# Altium schematic sheet CP2104-FO3-GM.SchDoc
size A4
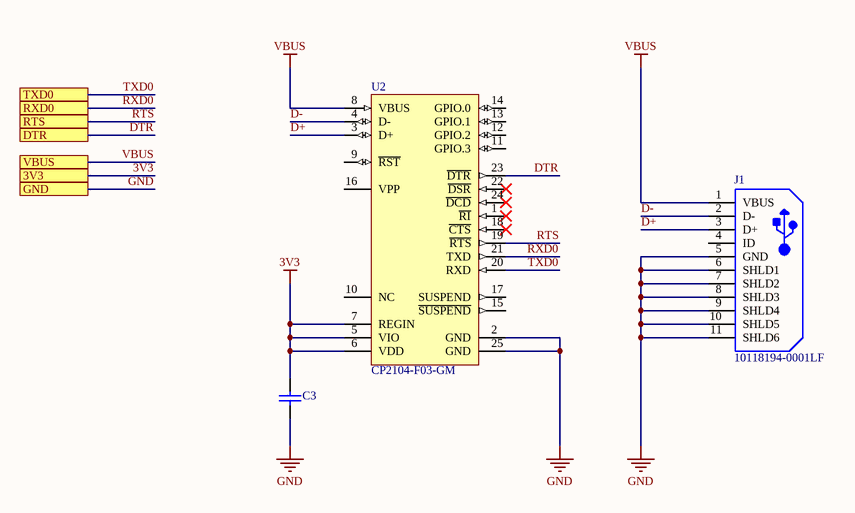
[diagram p0: CP2104-FO3-GM.SchDoc]

## Parts
C3  C0805C106K4PACTU  [CAPC2013X140X50NL20T25]  (value not drawn)
J1  10118194-0001LF  [FCI-10118194-0001LF-5_V]
U2  CP2104-F03-GM  [SLAB-QFN-24-2675x2675TP_M]

## Ports
3V3, DTR, GND, RTS, RXD0, TXD0, VBUS

## Nets
3V3: C3.2 U2.5(VIO) U2.6(VDD) U2.7(REGIN) ; port 3V3
GND: C3.1 J1.5(GND) J1.6(SHLD1) J1.7(SHLD2) J1.8(SHLD3) J1.9(SHLD4) J1.10(SHLD5) J1.11(SHLD6) U2.2(GND) U2.25(GND) ; port GND
VBUS: J1.1(VBUS) U2.8(VBUS) ; port VBUS
D+: J1.3(D+) U2.3(D+)
D-: J1.2(D-) U2.4(D-)
DTR: U2.23(~{DTR}) ; port DTR
RTS: U2.19(~{RTS}) ; port RTS
RXD0: U2.21(TXD) ; port RXD0
TXD0: U2.20(RXD) ; port TXD0

Not connected (* = marked no-connect by the designer): J1 4(ID); U2 1(~{RI})* 9(~{RST}) 10(NC) 11(GPIO.3) 12(GPIO.2) 13(GPIO.1) 14(GPIO.0) 15(~{SUSPEND}) 16(VPP) 17(SUSPEND) 18(~{CTS})* 22(~{DSR})* 24(~{DCD})*

## Library data of the parts
C3 = CMP-2007-03242-1: 10µF ±10% 16V Ceramic Capacitor X5R 0805 (2012 Metric); Part Number: CL21A106KOQNNNG
J1 = CMP-2000-05120-1: Micro USB B Type Receptacle, 1.8 A, -55 to 85 degC, 5-Pin SMD, RoHS, Tape and Reel; Manufacturer: Amphenol FCI; Body Orientation: RightAngle; Number of Contacts: 5; Pitch: 0.65mm; Gender: RCP; Rad Hard: No; Package Reference: 10118194-0001LF-5; Mounting: SurfaceMount; Manufacturer URL: http://www.fci.com/; Packaging: CutTape; Datasheet URL: https://datasheet.ciiva.com/26945/getdatasheetpartid-418619-26945695.pdf; Termination Method: Solder; Package Description: 5-Pin Surface Mount Device, Body 8.05 x 5.53 mm, Pitch 0.65 mm; Type: MicroUSBTypeB; Datasheet Version: Rev. A, 10/2011
U2 = CMP-0511-00004-1: Single-Chip USB to UART Bridge, 4 Dig I/O Pins, Internal Oscillator, 1024 Bytes EEPROM, -40 to 85 degC, 24-pin QFN; Manufacturer: Silicon Labs; Sub-Family: USB Bridges; Internal Oscillator: TRUE; Mounting Technology: Surface Mount; ComponentLink3URL: http://www.silabs.com/Support%20Documents/TechnicalDocs/C8051F93x-92x.pdf; DatasheetVersion: Rev. 1.0; ComponentLink1URL: http://www.silabs.com/; Code_IPC: J-STD-020; ComponentLink2URL: http://www.silabs.com/Support%20Documents/TechnicalDocs/cp2104.pdf; Code_JEDEC: MO-220; PackageReference: QFN-24; ComponentLink3Description: Package Specification; PartNumber: CP2104-F03-GM; ComponentLink1Description: Manufacturer URL; ComponentLink2Description: Datasheet; EEPROM: 1024 Bytes; PackageDescription: 24-Pin Quad-Flat No-Leads Package, Body 4 x 4 mm, Pitch 0.5 mm